# EasyEDA Pro project Access Control Core.eprj, board V2.0.1 Interface PCB
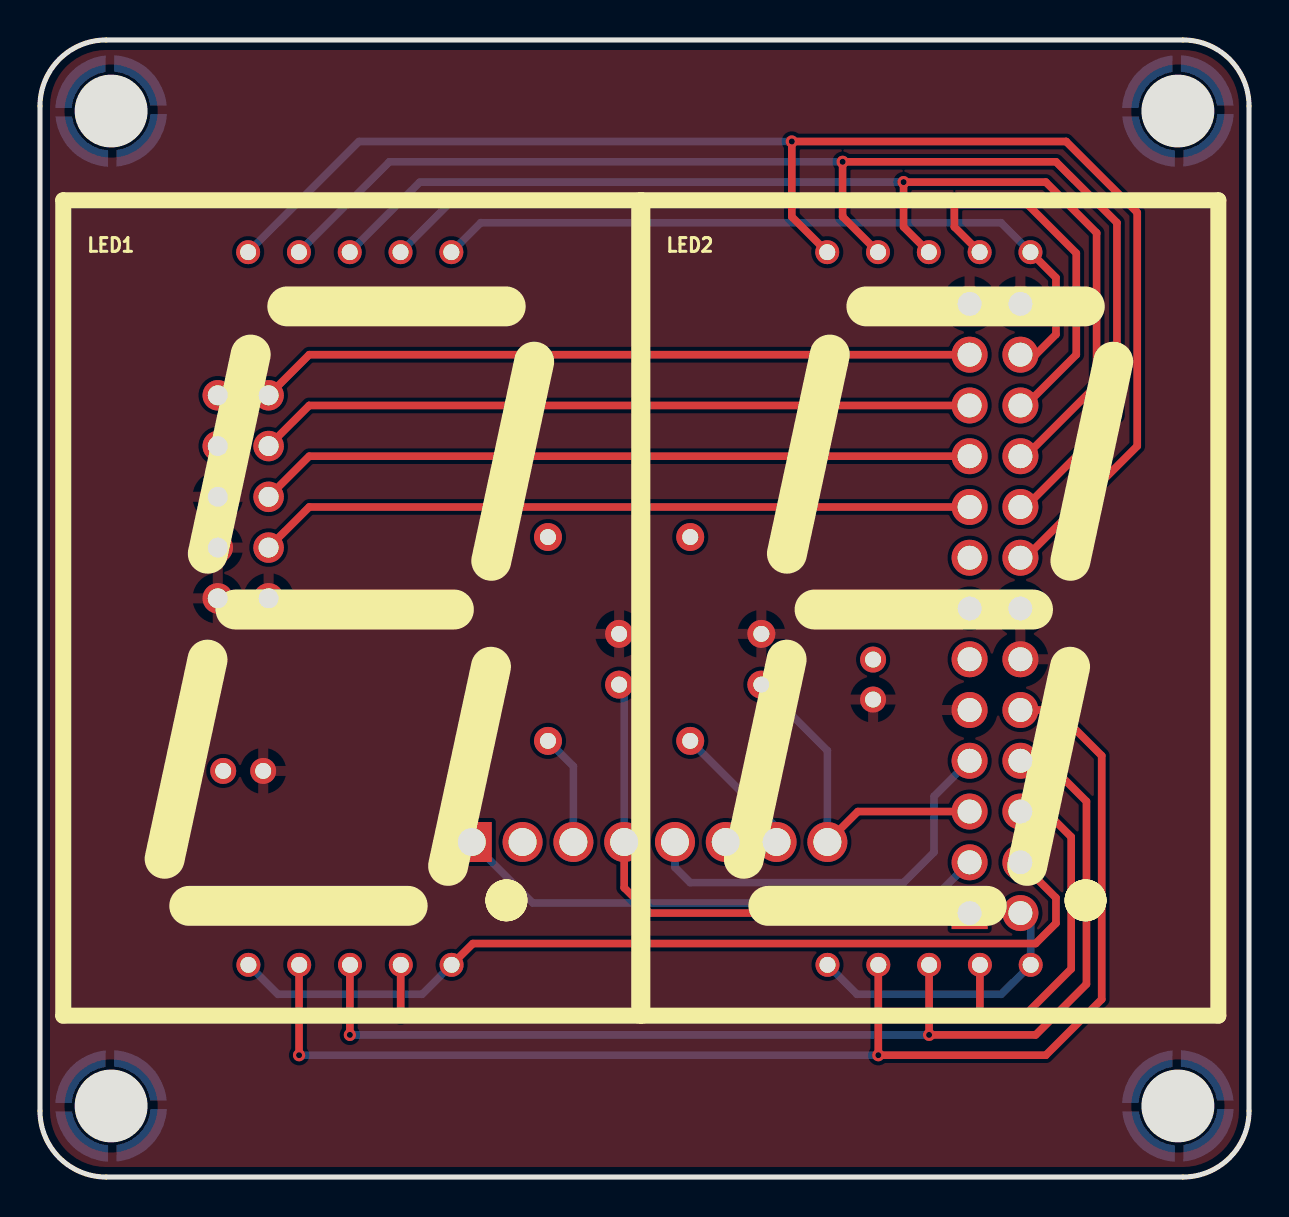
[diagram p11: board, top side]
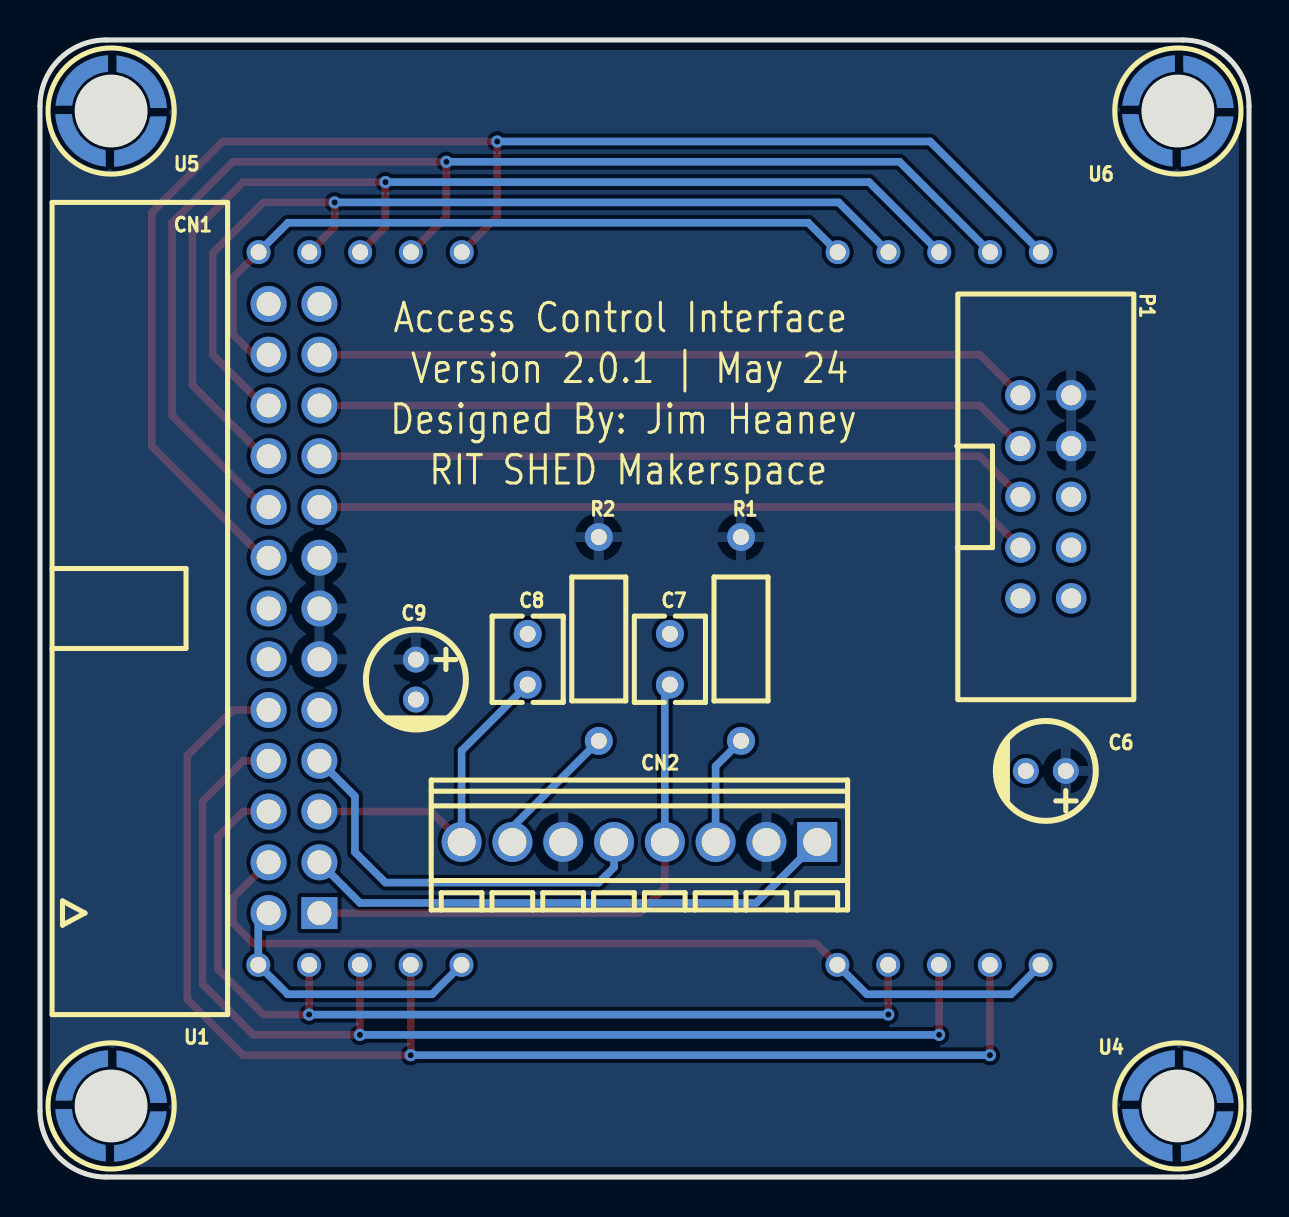
[diagram p12: board, bottom side, seen from below]

Outline 60.45 x 56.9 mm; copper layers: Top Layer, Bottom Layer. Coordinates in mm from the lower left corner of the outline.
Outline path: 0,53.59 0,3.3 arc(0.97,0.97) 3.3,0 57.15,0 arc(59.48,0.97) 60.45,3.3 60.45,53.59 arc(59.48,55.93) 57.15,56.9 3.3,56.9 arc(0.97,55.93) 0,53.59
Stack: Top Layer 0.035mm / Dielectric1 1.51mm FR4 er 4.5 / Bottom Layer 0.035mm

## Design rules (mm)
template: JLCPCB Capability(Two Layers Board)
spacing copperThickness1oz (default): track to track 0.102, other pairs 0.152 to 0.3
spacing copperThickness2oz: track to track 0.203, other pairs 0.152 to 0.3
track width copperThickness1oz (default): min 0.127, default 0.254, max 2.54
track width copperThickness2oz: min 0.203, default 0.254, max 2.54
differential pair differentialPair (default): width min 0.127, default 0.254, max 2.54; gap min 0.152, default 0.152
via viaSize (default): diameter min 0.5, default 0.61, max 10; hole min 0.3, default 0.305, max 6.3

## Placement (name value [footprint] x y rotation side)
C6  100uF  [CAP-TH_BD5.0-P2.00-D0.8-FD]  10.16 20.32 0 bottom
C7  100nF  [CAP-TH_L4.2-W3.5-P2.54-D0.5]  28.96 25.91 270 bottom
C8  100nF  [CAP-TH_L4.2-W3.5-P2.54-D0.5]  36.07 25.91 270 bottom
C9  100uF  [CAP-TH_BD5.0-P2.00-D0.8-FD]  41.66 24.89 270 bottom
CN1  2.54-2*13P弯简牛  [IDC-TH_26P-P2.54_BOOMELE-2X13P-2.54MM-H]  47.75 28.45 270 bottom
CN2  XY308-2.54-8P  [CONN-TH_XY308-2.54-8P]  30.48 16.76 0 bottom
LED1  FJ12101AH  [LED-SEG-TH_10P-L28.8-W40.8-P2.54-S35.56-BL]  15.49 28.45 0 top
LED2  FJ12101AH  [LED-SEG-TH_10P-L28.8-W40.8-P2.54-S35.56-BL]  44.45 28.45 0 top
P1  2.54-2*5P简牛  [IDC-TH_10P-P2.54_C5665]  10.16 34.04 270 bottom
R1  100kΩ  [RES-TH_BD2.7-L6.2-P10.20-D0.4]  25.4 26.92 90 bottom
R2  100kΩ  [RES-TH_BD2.7-L6.2-P10.20-D0.4]  32.51 26.92 90 bottom
U1  SMTWEM2515STR  [SMD_BD5.0-D3.5]  56.9 3.56 180 bottom
U4  SMTWEM2515STR  [SMD_BD5.0-D3.5]  3.56 3.56 180 bottom
U5  SMTWEM2515STR  [SMD_BD5.0-D3.5]  56.9 53.34 180 bottom
U6  SMTWEM2515STR  [SMD_BD5.0-D3.5]  3.56 53.34 180 bottom

## Footprints (pads in the part's own frame, mm; a bottom-side part is the same pattern mirrored in y, then rotated)
CAP-TH_BD5.0-P2.00-D0.8-FD
  round 1.3 hole 0.8: 1(-1,0) 2(1,0)
CAP-TH_L4.2-W3.5-P2.54-D0.5
  round 1.4 hole 0.8: 1(-1.27,0) 2(1.27,0)
CONN-TH_XY308-2.54-8P
  rect 2x2 hole 1.4: 1(-8.89,0)
  round 2 hole 1.4: 2(-6.35,0) 3(-3.81,0) 4(-1.27,0) 5(1.27,0) 6(3.81,0) 7(6.35,0) 8(8.89,0)
IDC-TH_10P-P2.54_C5665
  round 1.524 hole 1: 1(-5.08,-1.27) 2(-5.08,1.27) 3(-2.54,-1.27) 4(-2.54,1.27) 5(0,-1.27) 6(0,1.27) 7(2.54,-1.27) 8(2.54,1.27) 9(5.08,-1.27) 10(5.08,1.27)
IDC-TH_26P-P2.54_BOOMELE-2X13P-2.54MM-H
  rect 1.6x1.8 hole 1.2: 1(15.24,1.27)
  round 1.8 hole 1.2: 2(15.24,-1.27) 3(12.7,1.27) 4(12.7,-1.27) 5(10.16,1.27) 6(10.16,-1.27) 7(7.62,1.27) 8(7.62,-1.27) 9(5.08,1.27) 10(5.08,-1.27) 11(2.54,1.27) 12(2.54,-1.27) 13(0,1.27) 14(0,-1.27) 15(-2.54,1.27) 16(-2.54,-1.27) 17(-5.08,1.27) 18(-5.08,-1.27) 19(-7.62,1.27) 20(-7.62,-1.27) 21(-10.16,1.27) 22(-10.16,-1.27) 23(-12.7,1.27) 24(-12.7,-1.27) 25(-15.24,1.27) 26(-15.24,-1.27)
LED-SEG-TH_10P-L28.8-W40.8-P2.54-S35.56-BL
  round 1.2 hole 0.8: 1(-5.074,-17.831) 2(-2.534,-17.831) 3(0.006,-17.831) 4(2.546,-17.831) 5(5.087,-17.831) 6(5.074,17.83) 7(2.534,17.83) 8(-0.006,17.83) 9(-2.546,17.83) 10(-5.087,17.83)
RES-TH_BD2.7-L6.2-P10.20-D0.4
  round 1.4 hole 0.8: 1(-5.1,0) 2(5.1,0)
SMD_BD5.0-D3.5
  custom 2.52x2.628 smd: 1(-1.529,-1.792) 1(1.529,1.792)
  custom 2.629x2.52 smd: 1(-1.466,1.847) 1(1.465,-1.847)

## Nets
As in the schematic.

Pads without a net: U1 1; U4 1; U5 1; U6 1

## Via types
v1: diameter 0.61, hole 0.305, Top Layer to Bottom Layer, 10 vias

## Routing (per net, layer and track width the routed paths; a pad name or vN(x,y) marks a point on that pad's centre or on a via; arc(x,y) is an arc through that point)
B1_LK: length 27
  Bottom Layer w0.381: CN2.1 24.64,13.72 44.45,13.72 CN1.3
B1_SW: length 28.1
  Top Layer w0.381: CN1.1 30.48,13.21 29.21,14.48 CN2.4
  Bottom Layer w0.381: C7.2 29.21,24.38 CN2.4
B2_LK: length 20.5
  Bottom Layer w0.381: CN1.7 44.7,19.05 44.7,16.26 43.18,14.73 32.51,14.73 31.75,15.49 CN2.5
B2_SW: length 17
  Top Layer w0.381: CN1.5 40.89,18.29 CN2.8
  Bottom Layer w0.381: C8.2 39.37,21.34 CN2.8
CS: length 35.9
  Top Layer w0.381: CN1.23 13.46,41.15 P1.1
DIG1: length 46.2
  Top Layer w0.381: CN1.4 50.8,13.97 50.8,12.7 49.78,11.68 21.65,11.68 LED1.5
  Bottom Layer w0.381: LED1.5 19.11,9.14 11.89,9.14 LED1.1
DIG2: length 14.2
  Bottom Layer w0.381: CN1.2 49.54,12.69 LED2.5 48.06,9.14 40.85,9.14 LED2.1
MISO: length 35.9
  Top Layer w0.381: CN1.17 13.46,33.53 P1.7
MOSI: length 35.9
  Top Layer w0.381: P1.5 13.46,36.07 CN1.19
SCK: length 35.9
  Top Layer w0.381: CN1.21 13.46,38.61 P1.3
SEGA: length 47.8
  Top Layer w0.381: CN1.22 49.28,38.61 51.82,41.15 51.82,46.23 49.28,48.77 v1(45.72,48.77) 45.72,47.54 LED2.7
  Bottom Layer w0.381: v1(45.72,48.77) 20.52,48.77 LED1.7
SEGB: length 37
  Top Layer w0.381: LED2.6 50.8,45 50.8,42.16 49.78,41.15 CN1.24
  Bottom Layer w0.381: LED1.6 22.04,47.75 48.05,47.75 LED2.6
SEGC: length 49.1
  Top Layer w0.381: CN1.6 50.29,18.29 51.56,17.02 51.56,10.41 49.28,8.13 v1(47,8.13) LED2.4 ; LED1.4 18.03,10.61 v1(18.03,8.13)
  Bottom Layer w0.381: v1(47,8.13) v1(18.03,8.13)
SEGD: length 58.2
  Top Layer w0.381: LED1.3 15.49,10.61 v1(15.49,7.11) ; LED2.3 v1(44.46,7.11) 49.78,7.11 52.32,9.65 52.32,18.8 50.29,20.83 CN1.8
  Bottom Layer w0.381: v1(44.46,7.11) v1(15.49,7.11)
SEGDP: length 56.8
  Top Layer w0.381: LED2.8 43.18,47.54 v1(43.18,49.78) 50.29,49.78 52.83,47.24 52.83,39.62 49.28,36.07 CN1.20
  Bottom Layer w0.381: v1(43.18,49.78) 18.99,49.78 LED1.8
SEGE: length 67.5
  Top Layer w0.381: CN1.10 50.8,23.37 53.09,21.08 53.09,8.89 50.29,6.1 v1(41.92,6.1) LED2.2 ; v1(12.95,6.1) 12.95,10.61 LED1.2
  Bottom Layer w0.381: v1(41.92,6.1) v1(12.95,6.1)
SEGF: length 65.7
  Top Layer w0.381: CN1.18 49.28,33.53 53.85,38.1 53.85,47.75 50.8,50.8 v1(40.13,50.8) 40.13,48.05 LED2.9
  Bottom Layer w0.381: v1(40.13,50.8) 17.47,50.8 LED1.9
SEGG: length 74.3
  Top Layer w0.381: LED2.10 37.59,48.05 v1(37.59,51.82) 51.31,51.82 54.86,48.26 54.86,36.58 49.28,30.99 CN1.16
  Bottom Layer w0.381: LED1.10 15.95,51.82 v1(37.59,51.82)
$1N1480: length 5.6
  Bottom Layer w0.381: CN2.3 26.67,20.55 R1.1
$1N2767: length 6.8
  Bottom Layer w0.381: CN2.7 36.83,17.51 R2.1

## Copper pours and planes (outline as drawn; the poured copper is in the pictures)
+5V on Bottom Layer: -7.11,57.91 68.07,57.91 68.07,-1.52 -7.11,-1.52
GND on Top Layer: 0,62.99 60.96,62.99 60.96,-6.6 0,-6.6

## Text on the board
Bottom Silkscreen Layer: RIT SHED Makerspace | Version 2.0.1 | May 24 | Access Control Interface | Designed By: Jim Heaney
